# EAGLE schematic IRF (EAGLE 6.5.0)
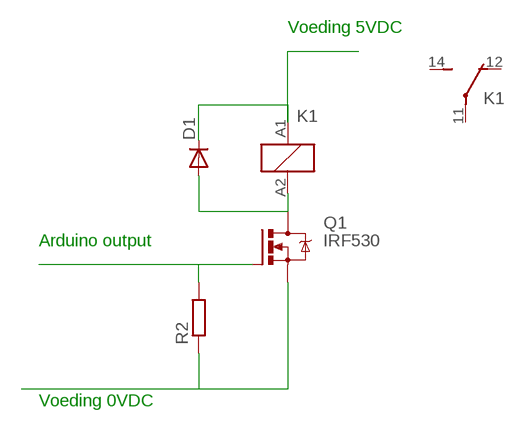
[diagram p0: schematic, sheet 1]

## Parts
D1  1N4148DO35-7  [DO35-7]
K1  FINDER-30.22  [FINDER-30.22]
Q1  IRF530  [TO220BV]
R2  R-EU_0309/12  [0309/12]

## Nets
N$1: D1.A K1.A2 Q1.D
N$2: Q1.G R2.2
N$3: Q1.S R2.1
N$4: D1.C K1.A1
Unconnected: K1.11(-1:P) K1.12(-1:O) K1.14(-1:S) K1.21(-2:P) K1.22(-2:O) K1.24(-2:S)

## Notes on the sheet
- Voeding 5VDC
- Arduino output
- Voeding 0VDC

## Library data of the parts
D1 = diode:1N4148: DIODE high speed (Philips)
K1 = relay:FINDER-30.22: SUBMINIATURE DIL-RELAIS FINDER 30.22.9.024.0000 Kontakt max. AC - 125V Distributor: Farnell Bestell Nr.: 1217371 Source: http://www.farnell.com/datasheets/87634.pdf; OC_FARNELL: unknown; OC_NEWARK: unknown
Q1 = transistor-power:IRF530: HEXFET Power MOSFET
R2 = resistor:R-EU_: RESISTOR, European symbol